# Altium schematic sheet LCD.SchDoc
size A4; DocumentNumber: 7; SheetNumber: 7; SheetTotal: 15
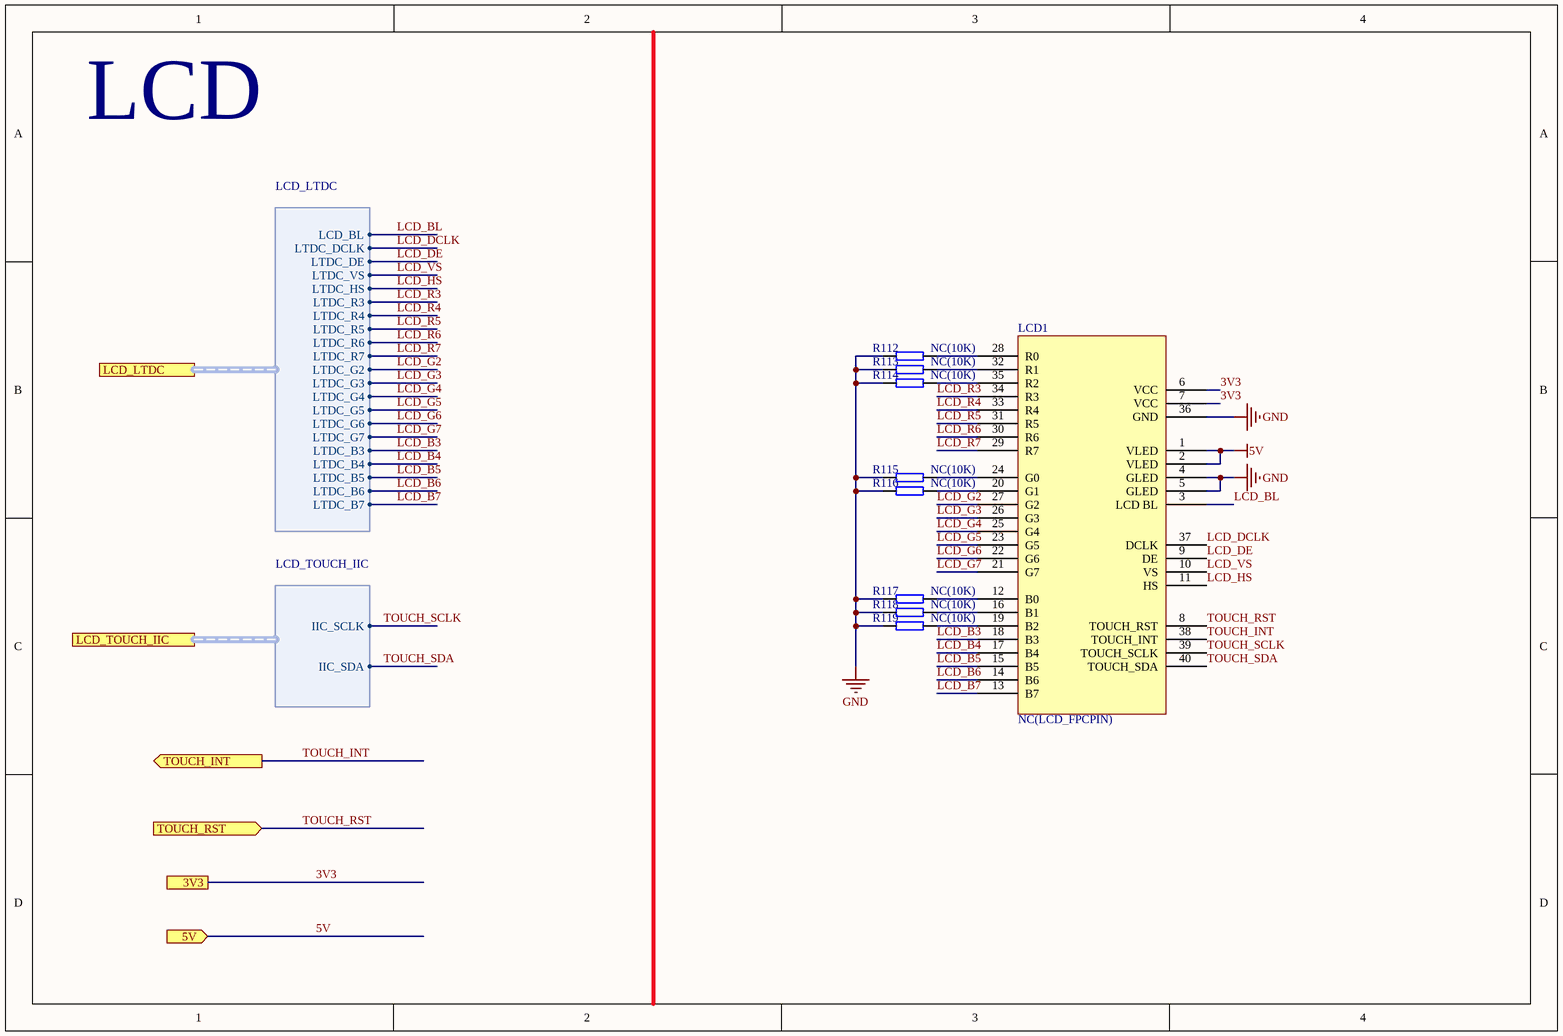
[diagram p0: LCD.SchDoc]

## Parts
LCD1  NC(LCD_FPCPIN)  [FPC40P-0.5-FK750M3]
R112  NC(10K)  [0402]
R113  NC(10K)  [0402]
R114  NC(10K)  [0402]
R115  NC(10K)  [0402]
R116  NC(10K)  [0402]
R117  NC(10K)  [0402]
R118  NC(10K)  [0402]
R119  NC(10K)  [0402]

## Ports
3V3, 5V (in), LCD_LTDC (harness LCD_LTDC), LCD_TOUCH_IIC (harness LCD_TOUCH_IIC), TOUCH_INT (out), TOUCH_RST (in)

## Harnesses
LCD_LTDC: LCD_BL, LTDC_DCLK, LTDC_DE, LTDC_VS, LTDC_HS, LTDC_R3, LTDC_R4, LTDC_R5, LTDC_R6, LTDC_R7, LTDC_G2, LTDC_G3, LTDC_G4, LTDC_G5, LTDC_G6, LTDC_G7, LTDC_B3, LTDC_B4, LTDC_B5, LTDC_B6, LTDC_B7
LCD_TOUCH_IIC: IIC_SCLK, IIC_SDA

## Nets
5V: LCD1.1(VLED) LCD1.2(VLED) ; port 5V
GND: LCD1.4(GLED) LCD1.5(GLED) LCD1.36(GND) R112.2 R113.2 R114.2 R115.2 R116.2 R117.2 R118.2 R119.2
3V3: LCD1.6(VCC) LCD1.7(VCC) ; port 3V3
LCD_B3: LCD1.18(B3) ; port LCD_LTDC.LTDC_B3
LCD_B4: LCD1.17(B4) ; port LCD_LTDC.LTDC_B4
LCD_B5: LCD1.15(B5) ; port LCD_LTDC.LTDC_B5
LCD_B6: LCD1.14(B6) ; port LCD_LTDC.LTDC_B6
LCD_B7: LCD1.13(B7) ; port LCD_LTDC.LTDC_B7
LCD_BL: LCD1.3(LCD_BL) ; port LCD_LTDC.LCD_BL
LCD_DCLK: LCD1.37(DCLK) ; port LCD_LTDC.LTDC_DCLK
LCD_DE: LCD1.9(DE) ; port LCD_LTDC.LTDC_DE
LCD_G2: LCD1.27(G2) ; port LCD_LTDC.LTDC_G2
LCD_G3: LCD1.26(G3) ; port LCD_LTDC.LTDC_G3
LCD_G4: LCD1.25(G4) ; port LCD_LTDC.LTDC_G4
LCD_G5: LCD1.23(G5) ; port LCD_LTDC.LTDC_G5
LCD_G6: LCD1.22(G6) ; port LCD_LTDC.LTDC_G6
LCD_G7: LCD1.21(G7) ; port LCD_LTDC.LTDC_G7
LCD_HS: LCD1.11(HS) ; port LCD_LTDC.LTDC_HS
LCD_R3: LCD1.34(R3) ; port LCD_LTDC.LTDC_R3
LCD_R4: LCD1.33(R4) ; port LCD_LTDC.LTDC_R4
LCD_R5: LCD1.31(R5) ; port LCD_LTDC.LTDC_R5
LCD_R6: LCD1.30(R6) ; port LCD_LTDC.LTDC_R6
LCD_R7: LCD1.29(R7) ; port LCD_LTDC.LTDC_R7
LCD_VS: LCD1.10(VS) ; port LCD_LTDC.LTDC_VS
TOUCH_INT: LCD1.38(TOUCH_INT) ; port TOUCH_INT
TOUCH_RST: LCD1.8(TOUCH_RST) ; port TOUCH_RST
TOUCH_SCLK: LCD1.39(TOUCH_SCLK) ; port LCD_TOUCH_IIC.IIC_SCLK
TOUCH_SDA: LCD1.40(TOUCH_SDA) ; port LCD_TOUCH_IIC.IIC_SDA
NetLCD1_12: LCD1.12(B0) R117.1
NetLCD1_16: LCD1.16(B1) R118.1
NetLCD1_19: LCD1.19(B2) R119.1
NetLCD1_20: LCD1.20(G1) R116.1
NetLCD1_24: LCD1.24(G0) R115.1
NetLCD1_28: LCD1.28(R0) R112.1
NetLCD1_32: LCD1.32(R1) R113.1
NetLCD1_35: LCD1.35(R2) R114.1

## Notes on the sheet
- LCD

## Library data of the parts
LCD1 = MY-RGB
R112-R119 = RES